# Altium schematic sheet 105358-3SC001-01-A_CPU_BRD.SchDoc: CPU Board
size 420 x 297 mm; DrawnBy: JeSa , KaKa; Organization: Hotswap Norden AB; Address1: Knarrarnäsgatan 7; Address2: SE-164 40 Kista; Address3: Sweden; DocumentNumber: 105358-3SC001-01; SheetNumber: 4; SheetTotal: 5; PageSetup: Record=PageOptions|CenterHorizontal=True|CenterVertical=True|PrintScale=0.96|XCorrection=1.00|YCorrection=1.00|PrintKind=0|BorderSize=5000000|LeftOffset=0|BottomOffset=0|Orientation=2|PaperLength=1000|PaperWidth=1000|Scale=100|PaperSource=7|PrintQuality=-4|MediaType=1|DitherType=10|PaperKind=A3|PrintScaleMode=1
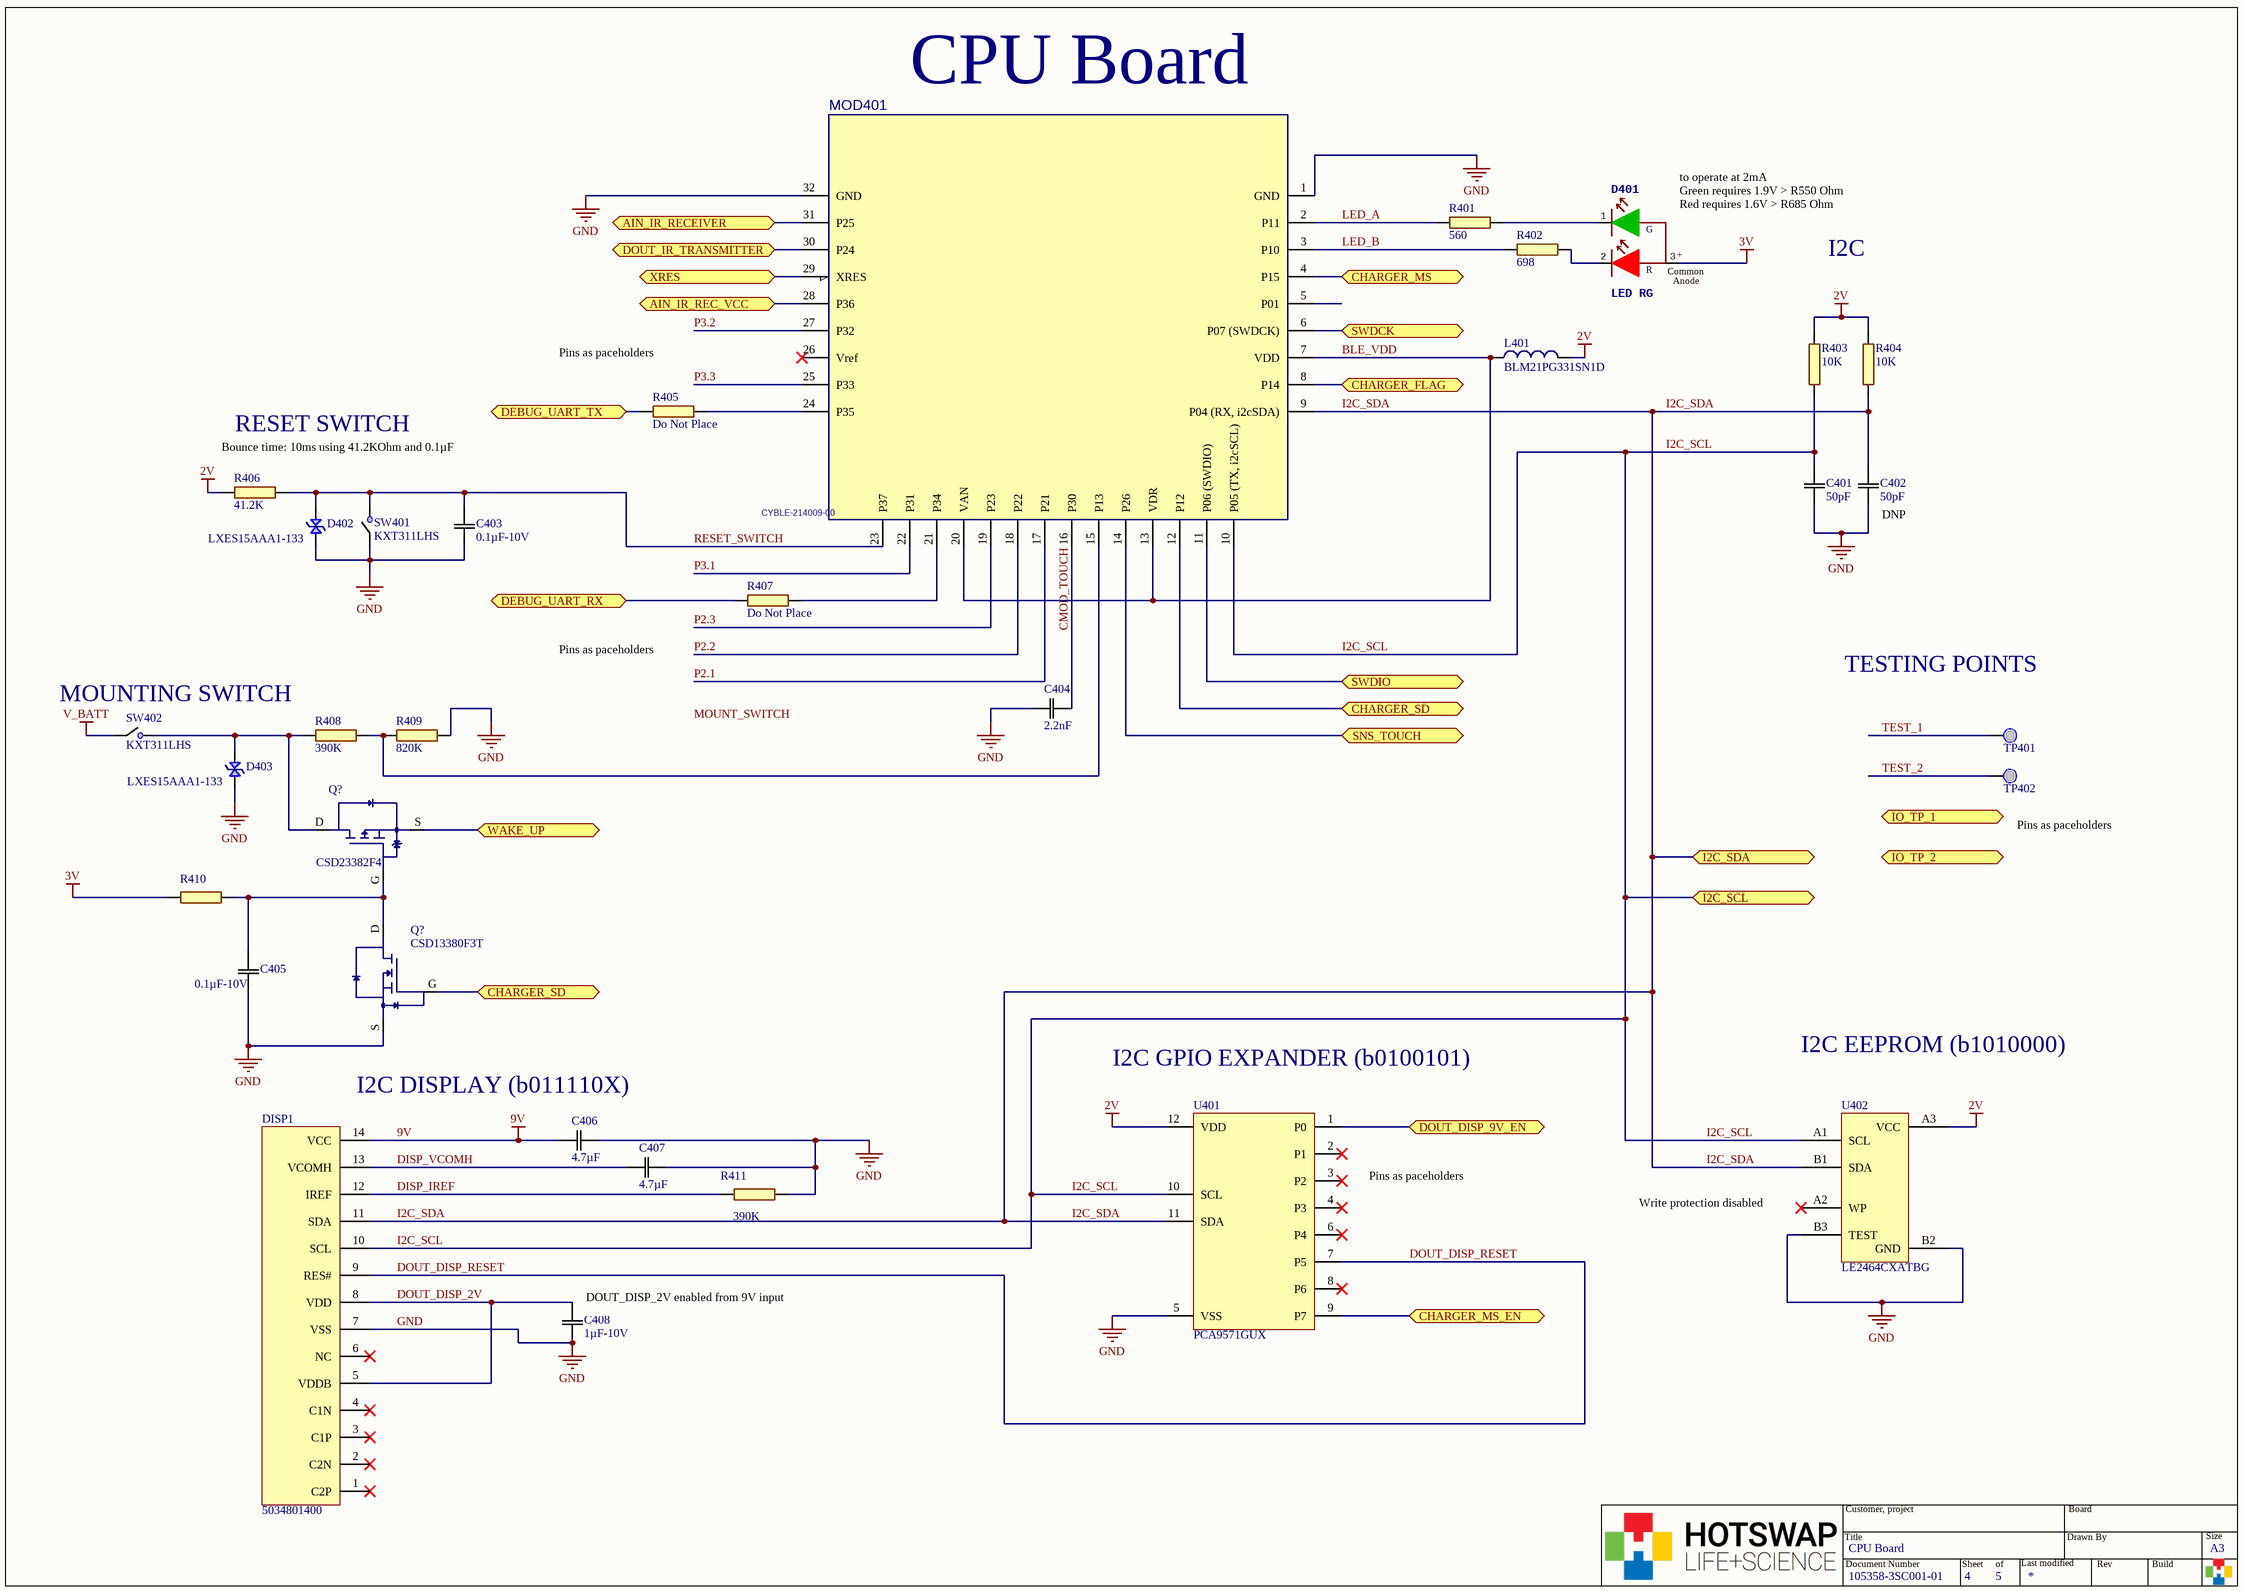
[diagram p0: 105358-3SC001-01-A_CPU_BRD.SchDoc]

## Parts
(Parts that share a designator on the sheet are numbered #1, #2 ... from top to bottom, then left to right.)
C401  50pF  [0603C_HIGH_DENSITY]
C402  50pF  [0603C_HIGH_DENSITY]
C403  0.1µF-10V  [0402C_HIGH_DENSITY]
C404  2.2nF  [0402C_HIGH_DENSITY]
C405  0.1µF-10V  [0402C_HIGH_DENSITY]
C406  4.7µF  [0402C_HIGH_DENSITY]
C407  4.7µF  [0402C_HIGH_DENSITY]
C408  1µF-10V  [0402C_HIGH_DENSITY]
D401  LED RG  [LED GRN/RED DIFF 1208 R/A SMD]
D402  LXES15AAA1-133  [0402C-GENERIC]
D403  LXES15AAA1-133  [0402C-GENERIC]
DISP1  5034801400  [5034801400]  (no BOM)
L401  BLM21PG331SN1D  [0805L_HIGH_DENSITY - Hybrid 0402]
MOD401  CYBLE-214009-00  [CYBLE-014008-00_MinKeepOut]
Q?#1  CSD23382F4  [CSD23382F4 -DFN65P100X35-3L]
Q?#2  CSD13380F3T  [CSD13380F3-DFN40P69X35-3L]
R401  560  [0402R-GENERIC]
R402  698  [0402R-GENERIC]
R403  10K  [0402R-GENERIC]
R404  10K  [0402R-GENERIC]
R405  Do Not Place  [0402R-GENERIC]
R406  41.2K  [0402R-GENERIC]
R407  Do Not Place  [0402R-GENERIC]
R408  390K  [0402R-GENERIC]
R409  820K  [0402R-GENERIC]
R410  (no value)  [0402R-GENERIC]
R411  390K  [0402R-GENERIC]
SW401  KXT311LHS  [KXT311LHS_B]
SW402  KXT311LHS  [KXT311LHS_B]
TP401  TEST POINT  [PAD TEST POINT]  (value not drawn)  (no BOM)
TP402  TEST POINT  [PAD TEST POINT]  (value not drawn)  (no BOM)
U401  PCA9571GUX  [PCA9571-XQFN12]
U402  LE2464CXATBG  [LE2464C-WLCSP6]

## Ports
AIN_IR_REC_VCC, AIN_IR_RECEIVER, CHARGER_FLAG, CHARGER_MS, CHARGER_MS_EN, CHARGER_SD, DEBUG_UART_RX, DEBUG_UART_TX, DOUT_DISP_9V_EN, DOUT_IR_TRANSMITTER, I2C_SCL, I2C_SDA, IO_TP_1, IO_TP_2, SNS_TOUCH, SWDCK, SWDIO, WAKE_UP, XRES

## Nets
2V: L401.2 R403.1 R404.1 R406.1 U401.12(VDD) U402.A3(VCC)
3V: D401.3 R410.1
9V: C406.1 DISP1.14(VCC)
GND: C401.1 C402.1 C403.1 C404.2 C405.1 C406.2 C407.1 C408.1 D402.1 D403.1 DISP1.7(VSS) MOD401.1(GND) MOD401.32(GND) Q?#2.S R409.1 R411.2 SW401.1 U401.5(VSS) U402.B2(GND) U402.B3(TEST)
V_BATT: SW402.1
AIN_IR_REC_VCC: MOD401.28(P36) ; port AIN_IR_REC_VCC
AIN_IR_RECEIVER: MOD401.31(P25) ; port AIN_IR_RECEIVER
BLE_VDD: L401.1 MOD401.7(VDD) MOD401.13(VDR) MOD401.20(VAN)
CHARGER_FLAG: MOD401.8(P14) ; port CHARGER_FLAG
CHARGER_MS: MOD401.4(P15) ; port CHARGER_MS
CHARGER_MS_EN: U401.9(P7) ; port CHARGER_MS_EN
CHARGER_SD: MOD401.12(P12) Q?#2.G ; port CHARGER_SD
CMOD_TOUCH: C404.1 MOD401.16(P30)
DEBUG_UART_RX: R407.1 ; port DEBUG_UART_RX
DEBUG_UART_TX: R405.1 ; port DEBUG_UART_TX
DISP_IREF: DISP1.12(IREF) R411.1
DISP_VCOMH: C407.2 DISP1.13(VCOMH)
DOUT_DISP_2V: C408.2 DISP1.5(VDDB) DISP1.8(VDD)
DOUT_DISP_9V_EN: U401.1(P0) ; port DOUT_DISP_9V_EN
DOUT_DISP_RESET: DISP1.9(RES#) U401.7(P5)
DOUT_IR_TRANSMITTER: MOD401.30(P24) ; port DOUT_IR_TRANSMITTER
I2C_SCL: C401.2 DISP1.10(SCL) MOD401.10(P05_(TX,_i2cSCL)) R403.2 U401.10(SCL) U402.A1(SCL) ; port I2C_SCL
I2C_SDA: C402.2 DISP1.11(SDA) MOD401.9(P04_(RX,_i2cSDA)) R404.2 U401.11(SDA) U402.B1(SDA) ; port I2C_SDA
LED_A: MOD401.2(P11) R401.1
LED_B: MOD401.3(P10) R402.1
P2.1: MOD401.17(P21)
P2.2: MOD401.18(P22)
P2.3: MOD401.19(P23)
P3.1: MOD401.22(P31)
P3.2: MOD401.27(P32)
P3.3: MOD401.25(P33)
RESET_SWITCH: C403.2 D402.2 MOD401.23(P37) R406.2 SW401.2
SNS_TOUCH: MOD401.14(P26) ; port SNS_TOUCH
SWDCK: MOD401.6(P07_(SWDCK)) ; port SWDCK
SWDIO: MOD401.11(P06_(SWDIO)) ; port SWDIO
TEST_1: TP401.1(Test_Point)
TEST_2: TP402.1(Test_Point)
WAKE_UP: Q?#1.S ; port WAKE_UP
XRES: MOD401.29(XRES) ; port XRES
NetC405_2: C405.2 Q?#1.G Q?#2.D R410.2
NetD401_1: D401.1(R) R401.2
NetD401_2: D401.2(G) R402.2
NetD403_2: D403.2 Q?#1.D R408.1 SW402.2
NetMOD401_15: MOD401.15(P13) R408.2 R409.2
NetMOD401_21: MOD401.21(P34) R407.2
NetMOD401_24: MOD401.24(P35) R405.2

Not connected (* = marked no-connect by the designer): DISP1 1(C2P)* 2(C2N)* 3(C1P)* 4(C1N)* 6(NC)*; MOD401 5(P01) 26(Vref)*; U401 2(P1)* 3(P2)* 4(P3)* 6(P4)* 8(P6)*; U402 A2(WP)*

## Notes on the sheet
- CPU Board
- (near D401) to operate at 2mA
  Green requires 1.9V > R550 Ohm
  Red requires 1.6V > R685 Ohm
- I2C
- (near R405) Pins as paceholders
- (near R406) Bounce time: 10ms using 41.2KOhm and 0.1µF
- RESET SWITCH
- (near C402) DNP
- Pins as paceholders
- (near SW402) MOUNTING SWITCH
- TESTING POINTS
- (near TP402) Pins as paceholders
- I2C GPIO EXPANDER (b0100101)
- I2C EEPROM (b1010000)
- I2C DISPLAY (b011110X)
- Write protection disabled
- (near C408) DOUT_DISP_2V enabled from 9V input
- Labels drawn without touching a wire or pin: MOUNT_SWITCH
- Title
- Customer, project
- Drawn By
- Board
- Size
- Document Number
- Sheet
- of
- Last modified
- Rev
- Build
- A3
- (in symbol LED GRN/RED DIFF 1208 R/A SMD) +; Common; Anode

## Library data of the parts
C401 C402 = 0603C-50pF-50V: CAP CER 50PF 50V NP0 0603; Manufacturer Part Number: 06035A500JAT2A; Manufacturer: AVX Corporation; Temperature Coefficient: C0G, NP0; Tolerance: ±5%; Capacitance: 50pF; Digi-Key Part Number: 478-10324-1-ND; PackageReference: 0603; Voltage - Rated: 50V
C403 C405 = 0402C-0.1uF-10V: 0.1µF ±10% 10V X5R Ceramic Capacitor 0402; Manufacturer Part Number: CC0402KRX5R6BB104; Manufacturer: Yageo; Capacitance: 0.1µF; Digi-Key Part Number: 311-1336-1-ND; PackageReference: 0402; Temperature Coefficient: X5R; Tolerance: 10%; Voltage - Rated: 10V
C404 = 0402C-2.2nF-50V: 2.2nF ±10% 50V X5R Ceramic Capacitor 0402; Manufacturer Part Number: GRM155R61H222KA01D; Manufacturer: Murata Electronics North America; Capacitance: 2.2nF; Digi-Key Part Number: 490-8257-1-ND; PackageReference: 0402; Temperature Coefficient: X5R; Tolerance: 10%; Voltage - Rated: 50V
C406 C407 = 0402C-4.7uF-6.3V: 4.7µF ±10% 6.3V X5R Ceramic Capacitor 0402; Manufacturer Part Number: C1005X5R0J475K050BC; Manufacturer: TDK Corporation; Capacitance: 4.7µF; Digi-Key Part Number: 445-5947-1-ND; PackageReference: 0402; Temperature Coefficient: X5R; Tolerance: 10%; Voltage - Rated: 6.3V
C408 = 0402C-1uF-10V: 1µF ±10% 10V X5R Ceramic Capacitor 0402; Manufacturer Part Number: CC0402KRX5R6BB105; Manufacturer: Yageo; Capacitance: 1µF; Digi-Key Part Number: 311-1439-1-ND; PackageReference: 0402; Temperature Coefficient: X5R; Tolerance: 10%; Voltage - Rated: 10V
D401 = LED GRN/RED DIFF 1208 R/A SMD: Manufacturer: Stanley Electric Co; Manufacturer Part Number: BRPY1211F-TR; Color: Red, Green; Voltage - Forward (Vf) (Typ): 2.1V Green, 1.7V Red; Current - Test: 20mA Green, 20mA Red; Wavelength - Peak: 570nm Green, 660nm Red; Millicandela Rating: 8.8mcd Green, 17.6mcd Red; ComponentLink1Description: Datasheet; ComponentLink1URL: https://media.digikey.com/pdf/Data%20Sheets/Stanley%20Electric%20PDFs/1211F_Series.pdf; Digi-Key Part Number: 404-1089-1-ND
D402 D403 = TVS DIODE 15VWM 0402: Manufacturer: Murata Electronics North America; Type: Zener; Capacitance @ Frequency: 0.05pF @ 1MHz; Voltage - Reverse Standoff (Typ): 15V; Manufacturer Part Number: LXES15AAA1-133; Digi-Key Part Number: 490-13209-1-ND; PackageReference: 0402
DISP1 = Molex-5034801400: Connector molex to OLED Display; Manufacturer: Molex, LLC; Number of Positions: 14; Pitch: 0.020" (0.50mm); Flat Flex Type: FFC, FPC; FFC, FCB Thickness: 0.30mm; Mating Cycles: 10; Manufacturer Part Number: 5034801400; Digi-Key Part Number: WM1442CT-ND; ComponentLink1Description: Datasheet; ComponentLink1URL: http://www.molex.com/pdm_docs/sd/5034801400_sd.pdf; Contact Finish: Gold
L401 = BLM21PG331SN1D: 0805 Ferrite Bead 330Ohm@100MHz; Manufacturer: Murata Electronics North America; Number of Lines: 1; Current Rating (Max): 1.5A; Filter Type: Power Line; DC Resistance (DCR) (Max): 70 mOhm; Digi-Key Part Number: 490-5988-1-ND; Manufacturer Part Number: BLM21PG331SN1D; ComponentLink1Description: Datasheet; ComponentLink1URL: http://www.murata.com/en-global/products/productdata/8796733767710/S0580E.pdf; PackageReference: 0805 (2012 Metric); Impedance @ FRequency: 330 Ohm @ 100MHz
MOD401 = CYBLE-214009-00: BLE PSoC Module 4.1; Manufacturer: Cypress Semiconductor Corp; Protocol: Bluetooth v4.1; Frequency: 2.4GHz; Data Rate: 1Mbps; Power - Output: 3dBm; Sensitivity: -91dBm; Voltage - Supply: 1.7 V ~ 5.5 V; Current - Receiving: 16.4mA; Current - Transmitting: 15.6mA; Supplier 1: Digi-Key; Supplier Part Number 1: 428-3809-ND; ComponentLink1URL: http://www.cypress.com/file/223701/download; ComponentLink1Description: Datasheet; Manufacturer Part Number: CYBLE-214009-00; Digi-Key Part Number: 428-3809-ND
Q?#1 = CSD23382F4: MOSFET P-CH 12V 22A 3PICOSTAR; Manufacturer: Texas Instruments; FET Type: P-Channel; Digi-Key Part Number: 296-40003-1-ND; Manufacturer Part Number: CSD23382F4; Package / Case: 3-XFDFN; ComponentLink1Description: Datasheet; ComponentLink1URL: http://www.ti.com/lit/ds/symlink/csd23382f4.pdf
Q?#2 = CSD13380F3T: 12V N-CHANNEL FEMTOFET MOSFET; Manufacturer: Texas Instruments; Digi-Key Part Number: CSD13380F3T; Manufacturer Part Number: CSD13380F3T; FET Type: N-Channel; Package / Case: 3-XFDFN; ComponentLink1Description: Datasheet; ComponentLink1URL: http://www.ti.com/lit/ds/symlink/csd13380f3.pdf
R401 = 0402R-560 OHM-1%-0.063W: RES SMD 560OHM 1% 1/16W 0402; Manufacturer: Samsung Electro-Mechanics America, Inc.; Manufacturer Part Number: RC1005F561CS; Power: 0.063W; GENERIC_OK: YES; Digi-Key Part Number: 1276-3473-1-ND; Resistance (Ohms): 560Ohm; Tolerance: 1%; PackageReference: 0402; Features: Moisture Resistant
R402 = 0402R-698 OHM-1%-0.063W: RES SMD 698 OHM 1% 1/16W 0402; Manufacturer: Yageo; Manufacturer Part Number: RC0402FR-07698RL; Resistance (Ohms): 698Ohm; Power: 0.063W; GENERIC_OK: YES; Digi-Key Part Number: YAG3215CT-ND; Tolerance: 1%; PackageReference: 0402; Features: Moisture Resistant
R403 R404 = 0402R-10k OHM-1%-0.063W: RES SMD 10kOHM 1% 1/16W 0402; Manufacturer: Yageo; Manufacturer Part Number: RC0402FR-0710KL; Power: 0.063W; GENERIC_OK: YES; Digi-Key Part Number: 311-10.0KLRCT-ND; Resistance (Ohms): 10KOhm; Tolerance: 1%; PackageReference: 0402; Features: Moisture Resistant
R405 R407 = 0402R-Do Not Place
R406 = 0402R-41.2k OHM-1%-0.063W: RES SMD 41.2kOHM 1% 1/16W 0402; Manufacturer: Yageo; Manufacturer Part Number: RC0402FR-0741K2L; Power: 0.063W; GENERIC_OK: YES; Digi-Key Part Number: YAG3155CT-ND; Resistance (Ohms): 41.2KOhm; Tolerance: 1%; PackageReference: 0402
R408 R410 R411 = 0402R-390k OHM-1%-0.063W: RES SMD 390kOHM 1% 1/16W 0402; Manufacturer: Yageo; Manufacturer Part Number: RC0402FR-07390KL; Power: 0.063W; GENERIC_OK: YES; Digi-Key Part Number: YAG3143CT-ND; Resistance (Ohms): 390KOhm; Tolerance: 1%; PackageReference: 0402; Features: Moisture Resistant
R409 = 0402R-820k OHM-1%-0.063W: RES SMD 820kOHM 1% 1/16W 0402; Manufacturer: Yageo; Manufacturer Part Number: RC0402FR-07820KL; Power: 0.063W; GENERIC_OK: YES; Digi-Key Part Number: YAG3240CT-ND; Resistance (Ohms): 820KOhm; Tolerance: 1%; PackageReference: 0402
SW401 SW402 = KXT311LHS: SPST Tactile Switch; Manufacturer: C&K; Contact Rating @ Voltage: 0.05A @ 12VDC; Actuator Height off PCB, Vertical: 0.60mm; Operating Force: 100gf; Mechanical Life: 300,000 Cycles; Supplier 1: Digi-Key; Supplier Part Number 1: CKN10777TR-ND; ComponentLink1URL: http://www.ckswitches.com/media/1465/kxt3.pdf; ComponentLink1Description: Datasheet; Manufacturer Part Number: KXT 311 LHS; Mounting Type: Surface Mount; Digi-Key Part Number: CKN10777CT-ND
TP401 TP402 = TEST POINT: Testing Poiny
U401 = PCA9571GUX: IC I/O EXPANDER I2C 12XQFN; Manufacturer: NXP USA Inc.; Voltage - Supply: 1.1 V ~ 3.6 V; Clock Frequency: 1MHz; Interface: I²C; Output Type: Push-Pull; ComponentLink1URL: http://www.nxp.com/docs/en/data-sheet/PCA9571.pdf; ComponentLink1Description: Datasheet; Manufacturer Part Number: PCA9571GUX; PackageReference: 12-XFQFN; Digi-Key Part Number: 568-12400-1-ND
U402 = LE2464CXATBG: IC EEPROM 64KBIT 400KHZ 6WLCSP; Manufacturer: ON Semiconductor; Memory Interface: I²C; Voltage - Supply: 1.7 V ~ 3.6 V; Memory Type: Non-Volatile; Write Cycle Time - Word, Page: 5ms; ComponentLink1URL: http://www.onsemi.cn/PowerSolutions/document/LE2464C-D.PDF; ComponentLink1Description: Datasheet; Manufacturer Part Number: LE2464CXATBG; PackageReference: 6-XFBGA, WLCSP; Memory Forma: EEPROM; Clock Frequency: 400kHz; Digi-Key Part Number: LE2464CXATBGOSDKR-ND